# EAGLE design DMX Shield (EAGLE 5.06)
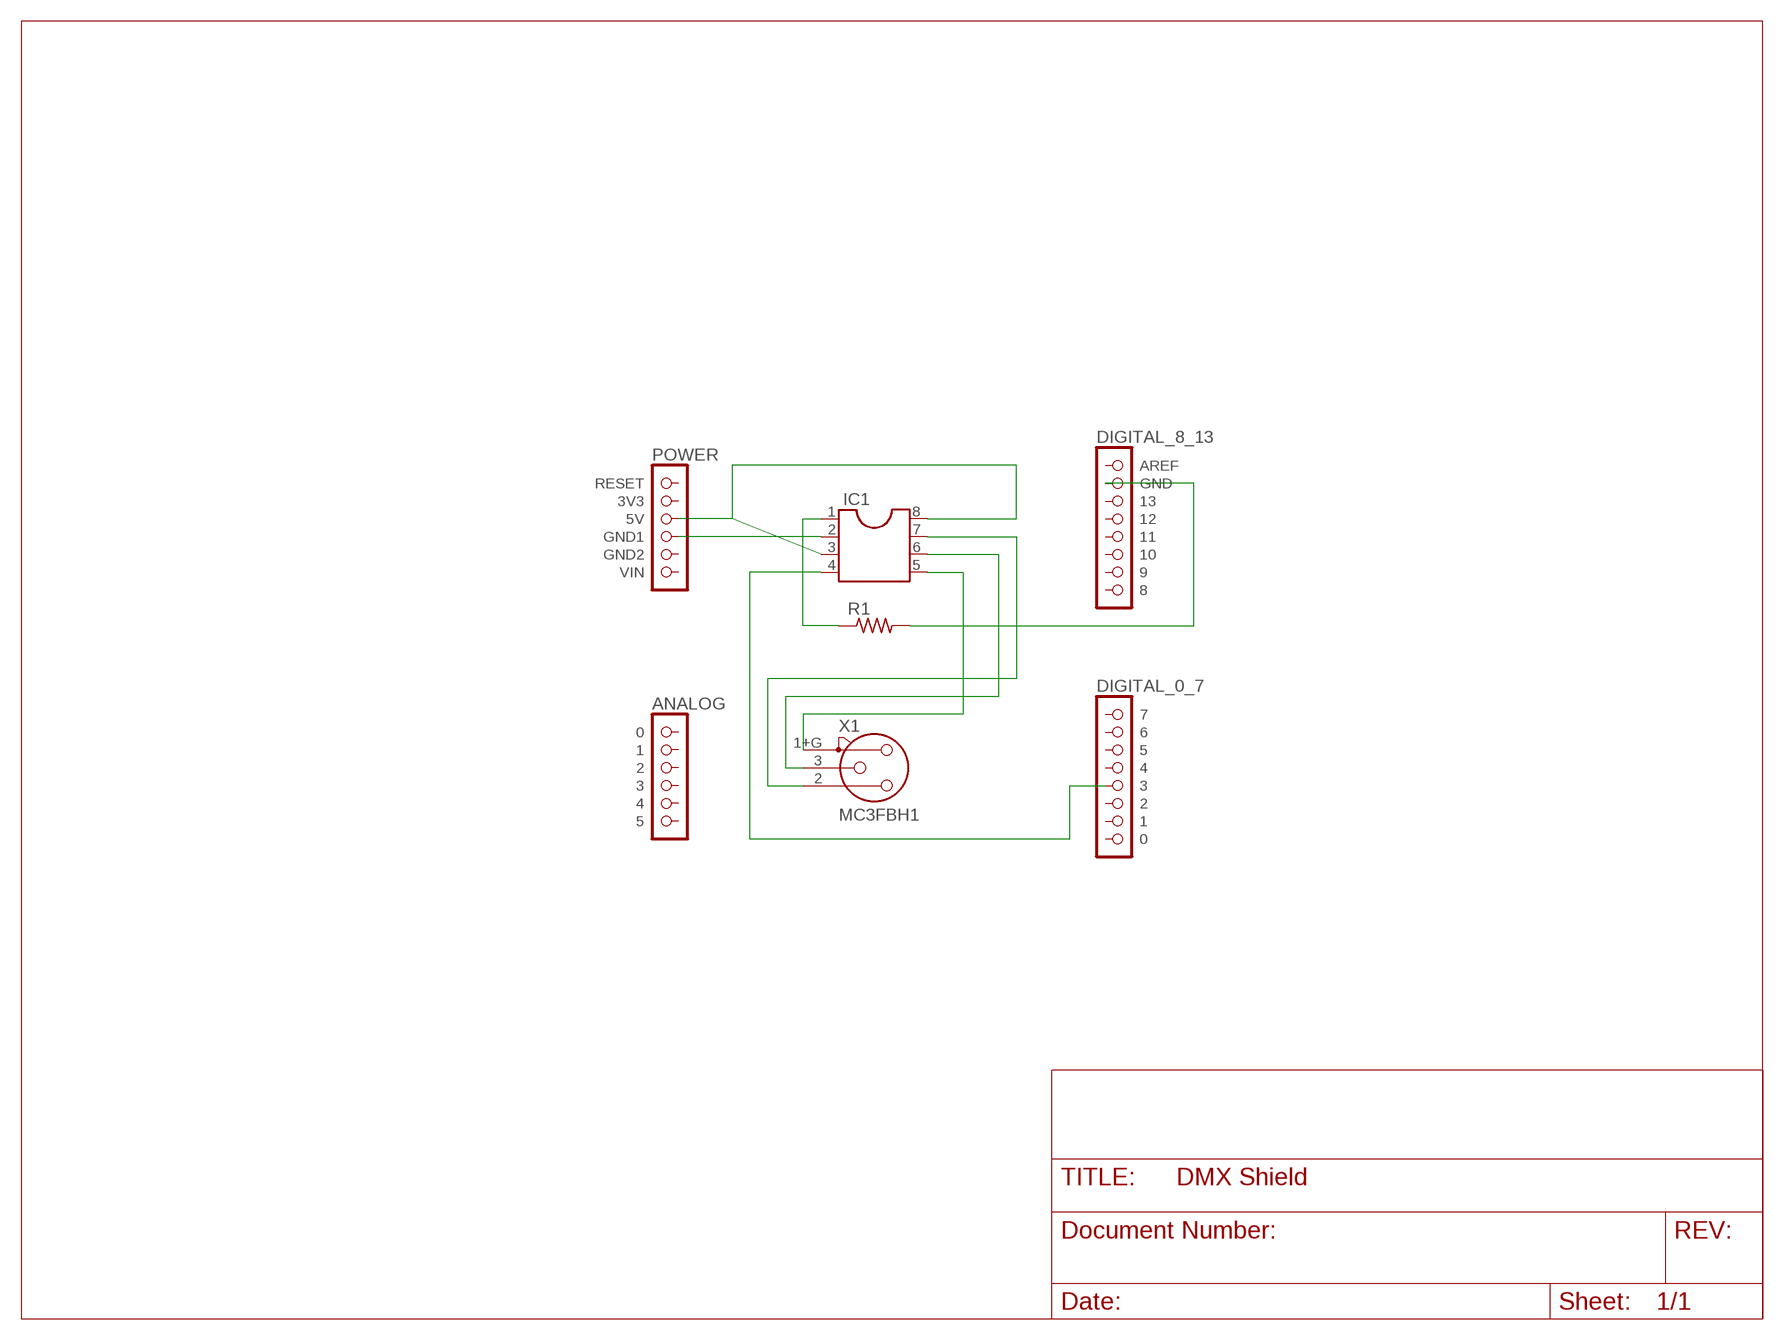
[diagram p0: schematic, sheet 1]

## Parts
IC1  DIL8  [DIL08]
R1  R-US_0207/10  [0207/10]
U$1  POWER  [1X06]
U$2  ANALOG  [1X06]
U$3  DIGITAL_0_7  [1X08]
U$4  DIGITAL_8_13  [1X08]
X1  MC3FBH1  [NC3FBH1]

## Nets
N$1: IC1.1 R1.1
N$2: IC1.5 R1.2 U$4.2(GND) X1.1+G
N$3: IC1.2 U$1.4(GND1)
N$4: IC1.3 IC1.8 U$1.3(5V)
N$5: IC1.4 U$3.5
N$7: IC1.6 X1.3
N$8: IC1.7 X1.2
Unconnected: U$1.1(RESET) U$1.2(3V3) U$1.5(GND2) U$1.6(VIN) U$2.1 U$2.2 U$2.3 U$2.4 U$2.5 U$2.6 U$3.1 U$3.2 U$3.3 U$3.4 U$3.6 U$3.7 U$3.8 U$4.1(AREF) U$4.3 U$4.4 U$4.5 U$4.6 U$4.7 U$4.8

## Library data of the parts
IC1 = ic-package:DIL8: Dual In Line / Socket
R1 = resistor:R-US_: RESISTOR, American symbol
U$1 = arduino:POWER
U$2 = arduino:ANALOG
U$3 = arduino:DIGITAL_0_7
U$4 = arduino:DIGITAL_8_13
X1 = con-neutrik_ag:MC3?: Neutrik Audio Connector XLR SERIES Stereo 1/4" jack Source: www.neutrik.com/

## Board
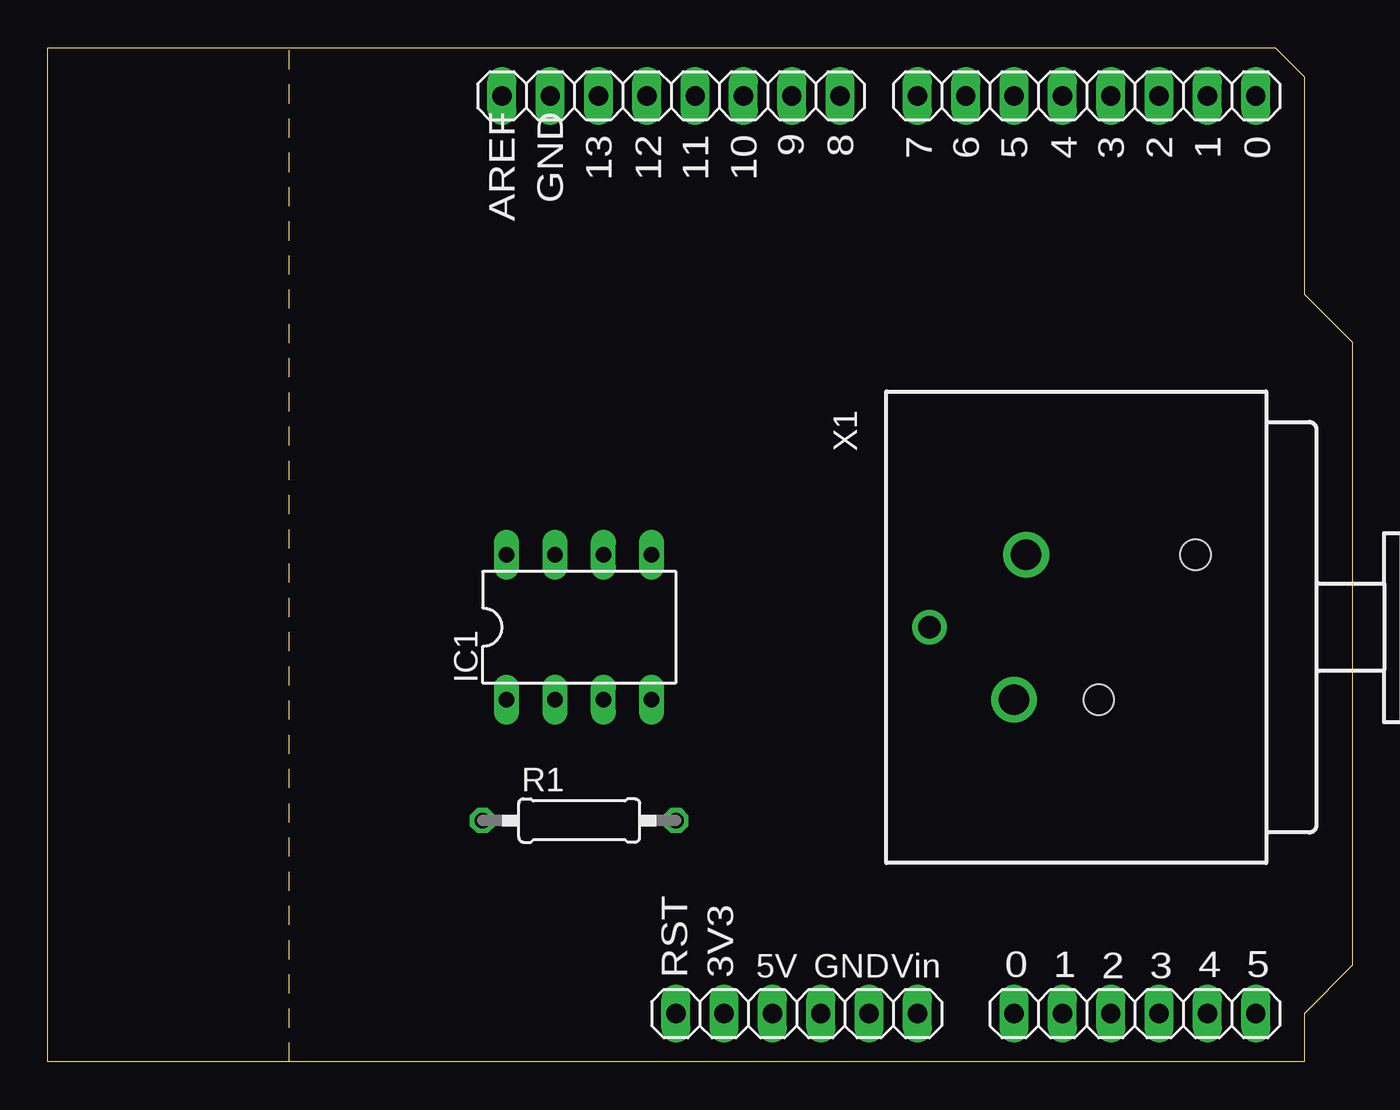
[diagram p1: board, top side]
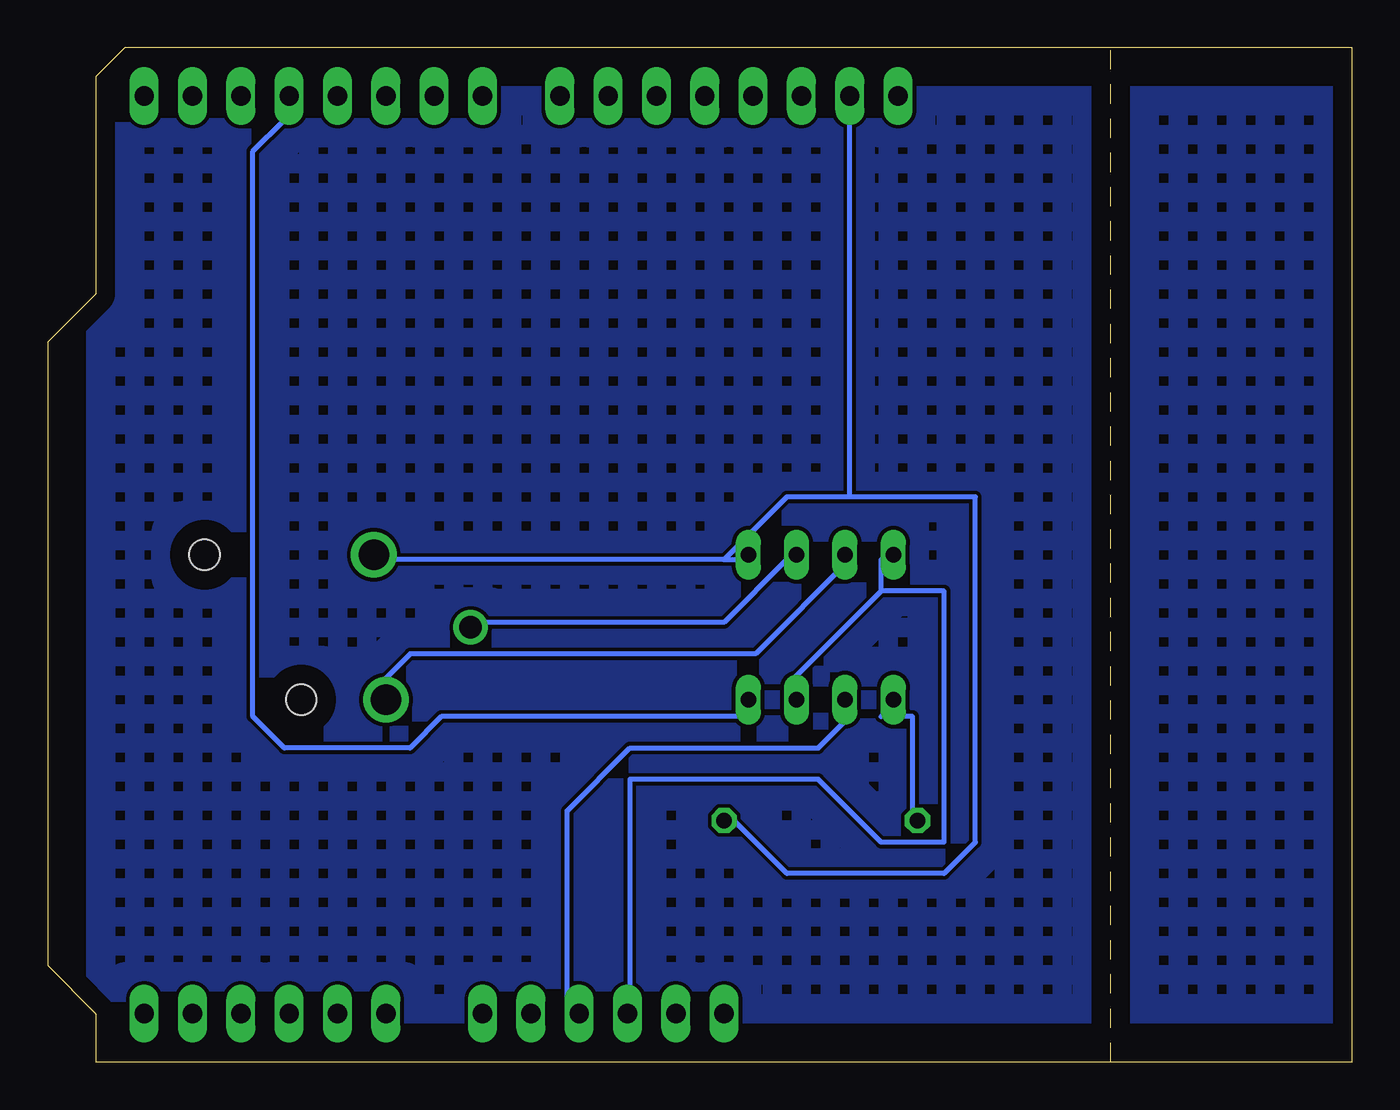
[diagram p2: board, bottom side, seen from below]

Size 68.58 x 53.34 mm. Coordinates in mm from the lower left corner, seen from the top.
Outline: 12.7,53.34 0,53.34 0,0 12.7,0
Outline: 12.7,53.34 64.52,53.34 66.04,51.82 66.04,40.39 68.58,37.85 68.58,5.08 66.04,2.54 66.04,0 12.7,0
Outline: 12.7,0 12.7,53.34
Copper layers (1*16): Top 0.035mm / dielectric 1.5mm / Bottom 0.035mm
Design rules "default": minimum track width 10mil, minimum drill 24mil, track to track 8mil, track to pad 8mil, pad to pad 8mil, via to via 8mil, smd to smd 8mil, copper to edge 40mil, drill to drill 8mil, minimum pad ring 10mil, minimum via ring 8mil, stop-mask expansion 4mil, vias tented up to drill 0mil, thermal gap 10mil

### Footprints (pad centres in the part's own frame; a part is rotated, then mirrored left to right if it is on the bottom)
DIL08 = drill 0.813 long: 1 -3.81,-3.81; 2 -1.27,-3.81; 3 1.27,-3.81; 4 3.81,-3.81; 5 3.81,3.81; 6 1.27,3.81; 7 -1.27,3.81; 8 -3.81,3.81
0207/10 = drill 0.813 octagon: 1 -5.08,0; 2 5.08,0
1X06 = drill 1.016 long: 1 -6.35,0; 2 -3.81,0; 3 -1.27,0; 4 1.27,0; 5 3.81,0; 6 6.35,0
1X08 = drill 1.016 long: 1 -8.89,0; 2 -6.35,0; 3 -3.81,0; 4 -1.27,0; 5 1.27,0; 6 3.81,0; 7 6.35,0; 8 8.89,0
NC3FBH1 = drill 1.6 round: 1+G -3.81,0.635; 2 3.81,0 | drill 1.2 round: 3 0,-4.45 | hole 1.6: -3.81,9.525; 3.81,4.445

### Placement (x,y rotation side)
IC1  27.94,22.86 0 top
R1  27.94,12.7 0 top
U$1  39.37,2.54 0 top
U$2  57.15,2.54 0 top
U$3  54.61,50.8 0 top
U$4  32.77,50.8 0 top
X1  50.8,22.86 270 top

### Tracks (layer width: path | path; a pad name or v marks a point on that pad's centre or on a via)
N$1
  Bottom 0.254: R1.1 23.11,13.21 23.11,18.16 24.77,18.16 IC1.1
N$2
  Bottom 0.254: 33.02,26.42 51.18,26.42 X1.1+G | 33.02,26.42 31.37,26.42 IC1.5 | 26.42,29.72 29.72,29.72 33.02,26.42 | 26.42,29.72 19.81,29.72 19.81,11.56 21.46,9.91 29.72,9.91 33.02,13.21 R1.2 | 26.42,29.72 U$4.2
N$3
  Bottom 0.254: IC1.2 26.42,18.16 28.07,16.51 37.97,16.51 41.27,13.21 41.27,3.3 U$1.4
N$4
  Bottom 0.254: 24.77,24.77 29.72,19.81 IC1.3 | 24.77,24.77 24.77,26.42 IC1.8 | 24.77,24.77 21.46,24.77 21.46,11.56 24.77,11.56 28.07,14.86 37.97,14.86 37.97,3.3 U$1.3
N$5
  Bottom 0.254: IC1.4 31.37,18.16 47.88,18.16 49.53,16.51 56.13,16.51 57.78,18.16 57.78,47.88 56.13,49.53 U$3.5
N$6
  pour Bottom (hatched): 0,2.54 66.04,2.54 66.04,50.8 0,50.8
N$7
  Bottom 0.254: IC1.6 29.72,26.42 33.02,23.11 46.23,23.11 X1.3
N$8
  Bottom 0.254: IC1.7 26.42,26.42 31.37,21.46 49.53,21.46 51.18,19.81 X1.2

### Text on the board
tNames: 9 | 8 | 7 | 6 | 5 | 4 | 3 | 2 | 1 | 0 | 13 | 12 | 11 | 10 | GND | AREF | RST | 3V3 | 5V | GND | Vin | 0 | 1 | 2 | 3 | 4 | 5